# EAGLE design temp_brick_smd (EAGLE 7.2.0)
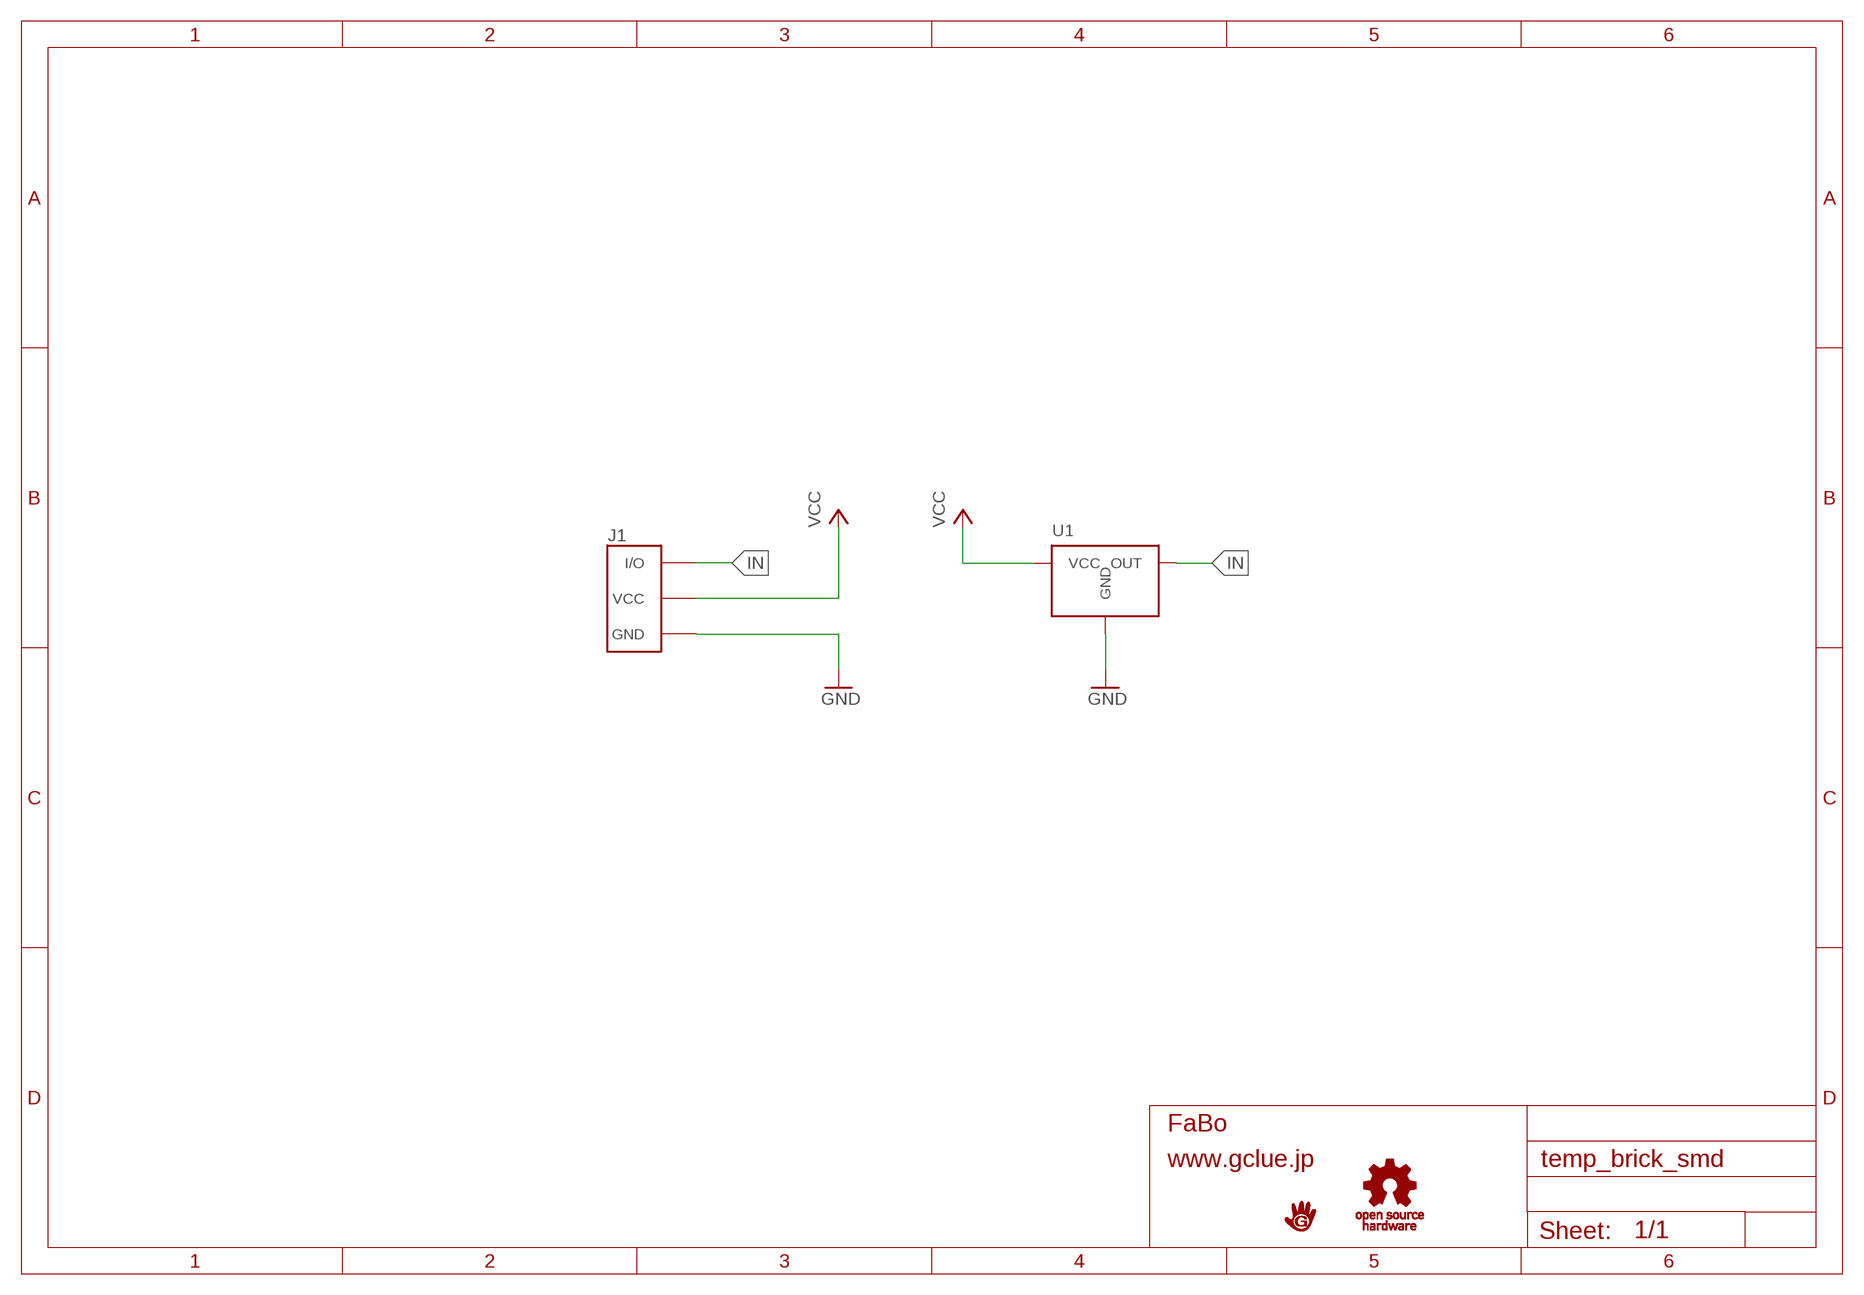
[diagram p0: schematic, sheet 1]

## Parts
J1  BRICK_3PIN  [BRICK_3PIN]
U1  SENSOR-LM60-SOT  [SENSOR-LM60-SOT-23]
U$2  LOGO_GCLUE-M  [LOGO_GCLUE_M]
U$3  LOGO_OSHW_T-M  [LOGO_OSHW_T_M]

## Nets
GND: J1.GND U1.GND
IN: J1.IN/OUT(I/O) U1.OUT
VCC: J1.VCC U1.VCC

## Library data of the parts
J1 = Gclue:BRICK_3PIN: FaBo Brick 3pin
U1 = Gclue:SENSOR-LM60-: LM60 Temperature Sensor
U$2 = Gclue:LOGO_GCLUE
U$3 = Gclue:LOGO_OSHW_T

## Board
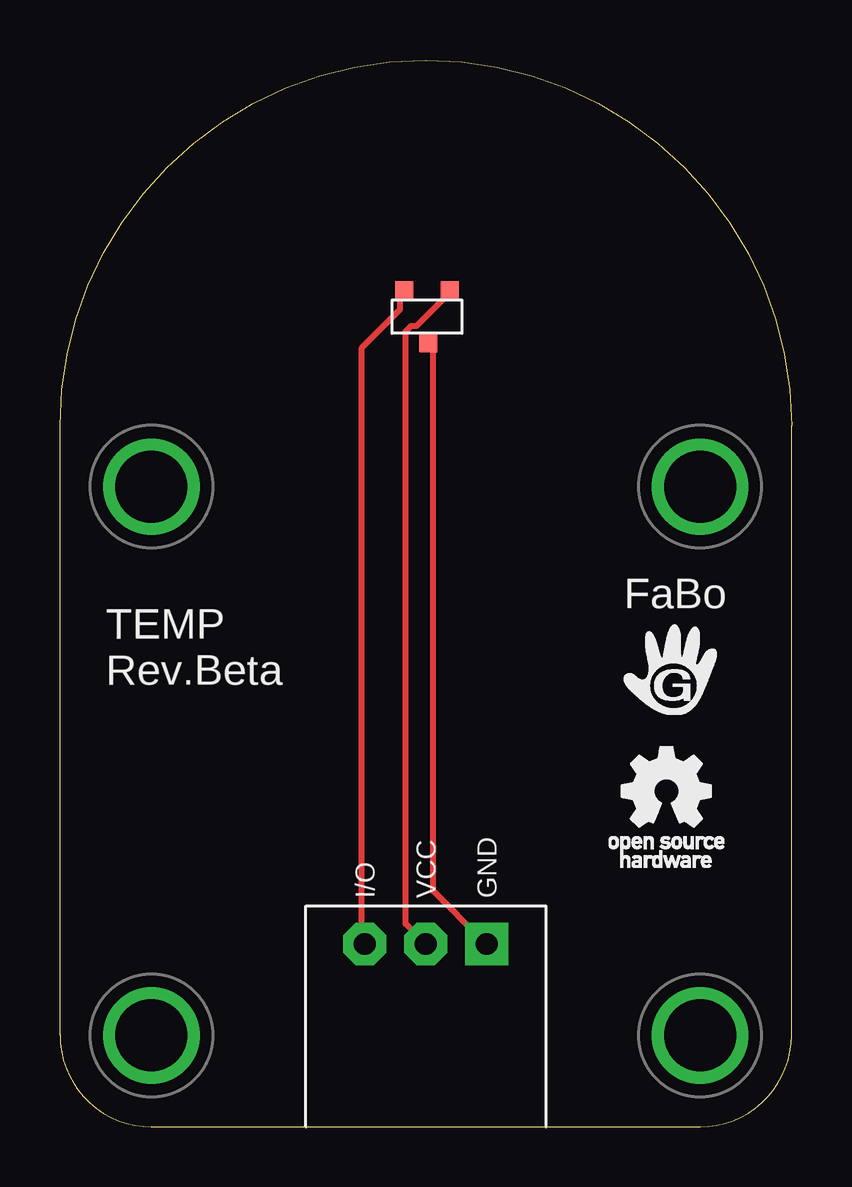
[diagram p1: board, top side]
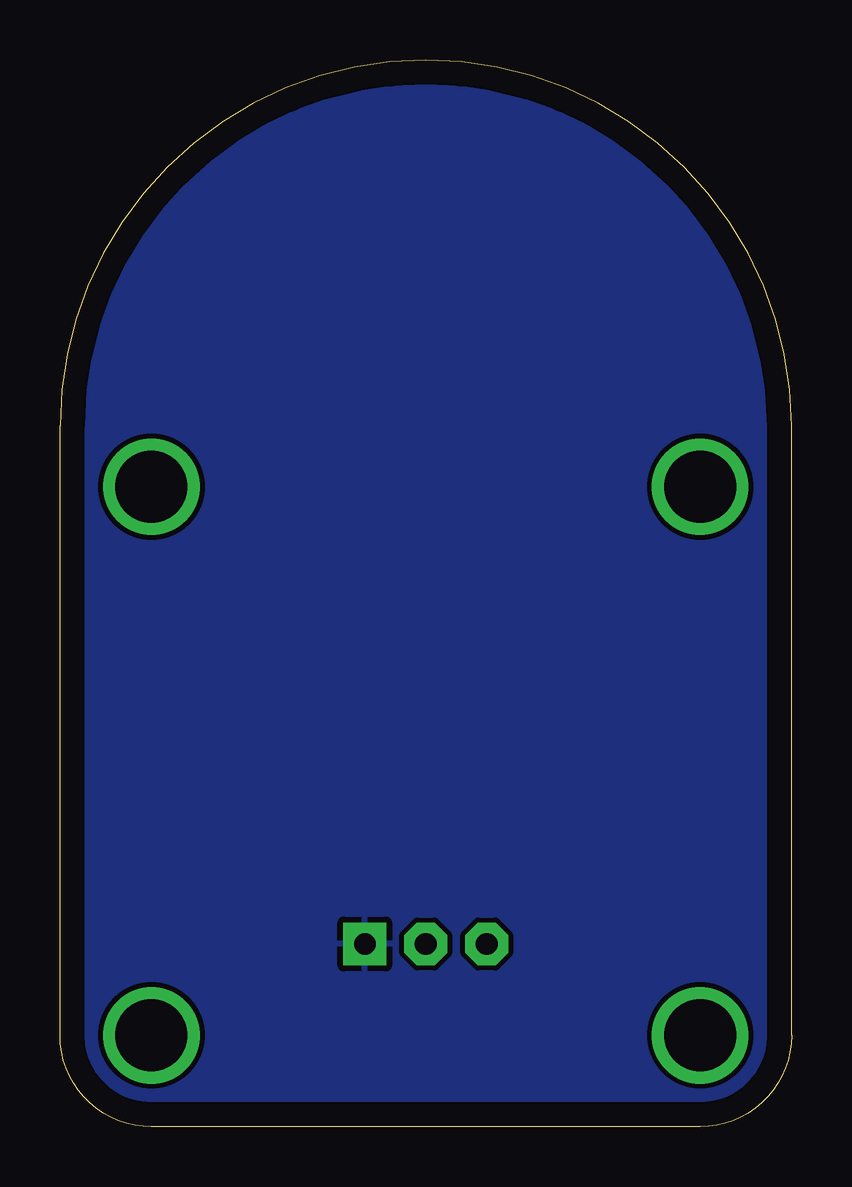
[diagram p2: board, bottom side, seen from below]

Size 30.48 x 44.45 mm. Coordinates in mm from the lower left corner, seen from the top.
Copper layers (1*16): Top 0.035mm / dielectric 1.5mm / Bottom 0.035mm
Design rules "default": minimum track width 10mil, minimum drill 24mil, track to track 8mil, track to pad 8mil, pad to pad 8mil, via to via 8mil, smd to smd 8mil, copper to edge 40mil, drill to drill 8mil, minimum pad ring 10mil, minimum via ring 8mil, stop-mask expansion 4mil, vias tented up to drill 0mil, thermal gap 10mil

### Footprints (pad centres in the part's own frame; a part is rotated, then mirrored left to right if it is on the bottom)
BRICK_3PIN = drill 0.9 pad 1.778 square: GND 2.54,-11.43 | drill 0.9 pad 1.778 octagon: IN/OUT -2.54,-11.43; VCC 0,-11.43 | drill 3 pad 3.81: P$1 -11.43,7.62; P$2 11.43,7.62; P$3 11.43,-15.24; P$4 -11.43,-15.24
SENSOR-LM60-SOT-23 = smd 0.76 x 0.76: GND -0.1,1; OUT 0.9,-1.2; VCC -1,-1.2

### Placement (x,y rotation side)
J1  15.24,19.05 0 top
U1  15.24,33.66 180 top
U$2  25.4,19.05 0 top
U$3  25.4,13.34 0 top

### Tracks (layer width: path | path; a pad name or v marks a point on that pad's centre or on a via)
GND
  Top 0.254: U1.GND 15.54,32.46 15.54,9.83 17.6,7.77 J1.GND
  pour Bottom: 0,0 30.48,0 30.48,44.45 0,44.45
IN
  Top 0.254: U1.OUT 14.17,34.75 14.17,34.06 12.57,32.46 12.57,7.77 J1.IN/OUT
VCC
  Top 0.254: J1.VCC 14.4,8.46 14.4,33.15 14.63,33.38 14.86,33.38 16.23,34.75 U1.VCC

### Text on the board
tPlace: FaBo | TEMP / Rev.Beta